# EAGLE design Monotron-002 (EAGLE 9.6.2)
AUTHOR: Peter Konecny; DATE: 13/04/2022; DRAWING_NUMBER: CV_MONOTRON-002; DRAWING_TITLE: Interface between eurorack CV and Monotron; INIT: PK; REV: 2

## Sheet 1 of 3: Block diagram
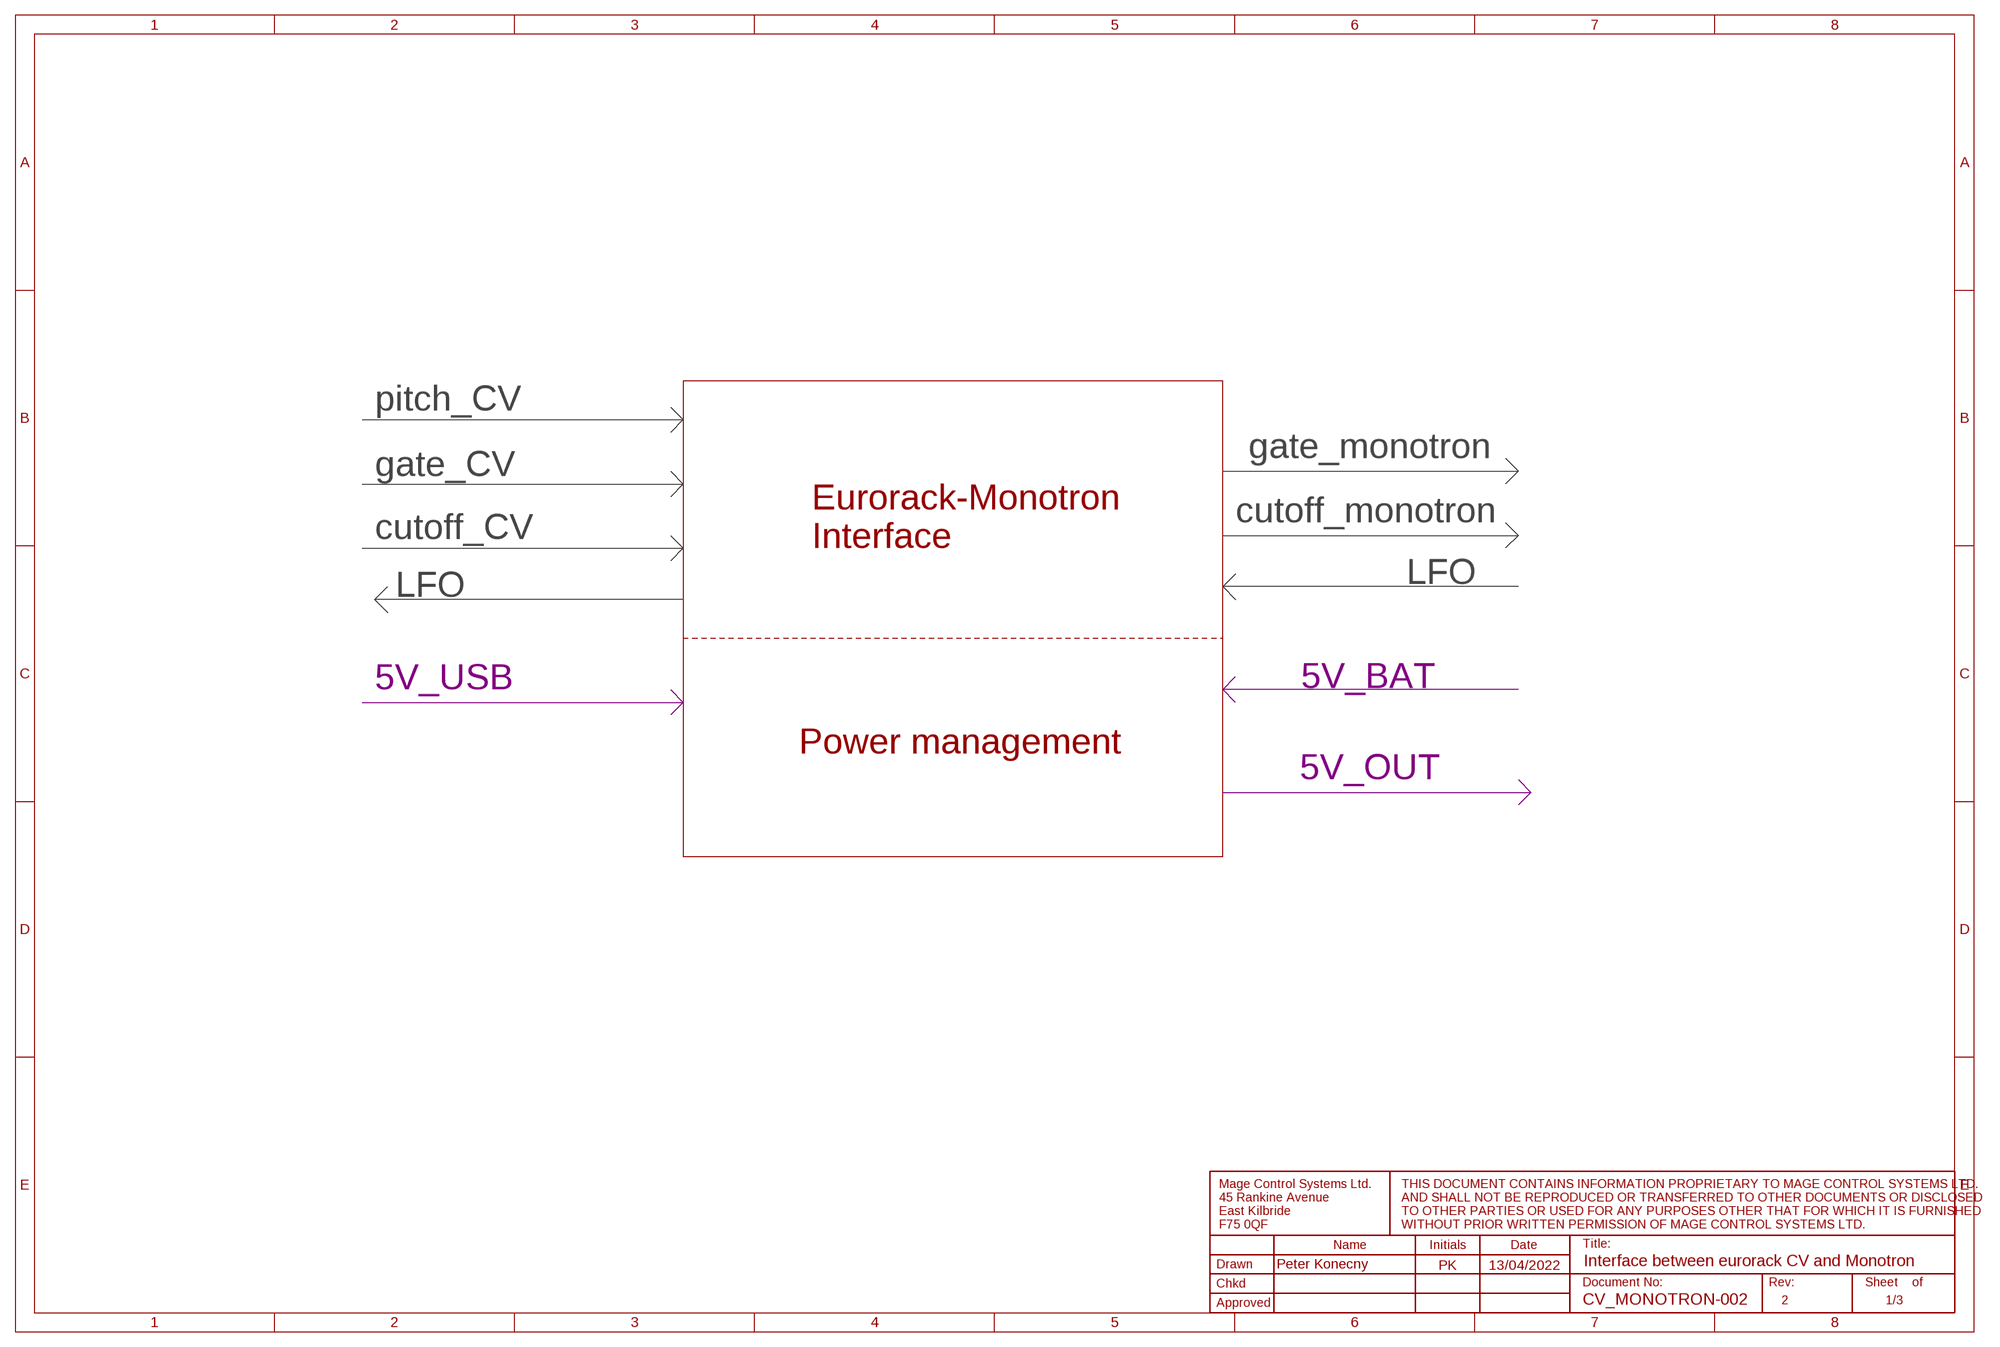
[diagram p0: schematic, sheet 1]

### Notes on the sheet
- pitch_CV
- gate_monotron
- gate_CV
- cutoff_monotron
- cutoff_CV
- Eurorack-Monotron 
  Interface
- LFO
- LFO
- 5V_USB | 5V_BAT
- Power management
- 5V_OUT

## Sheet 2 of 3: eurorack CV interface
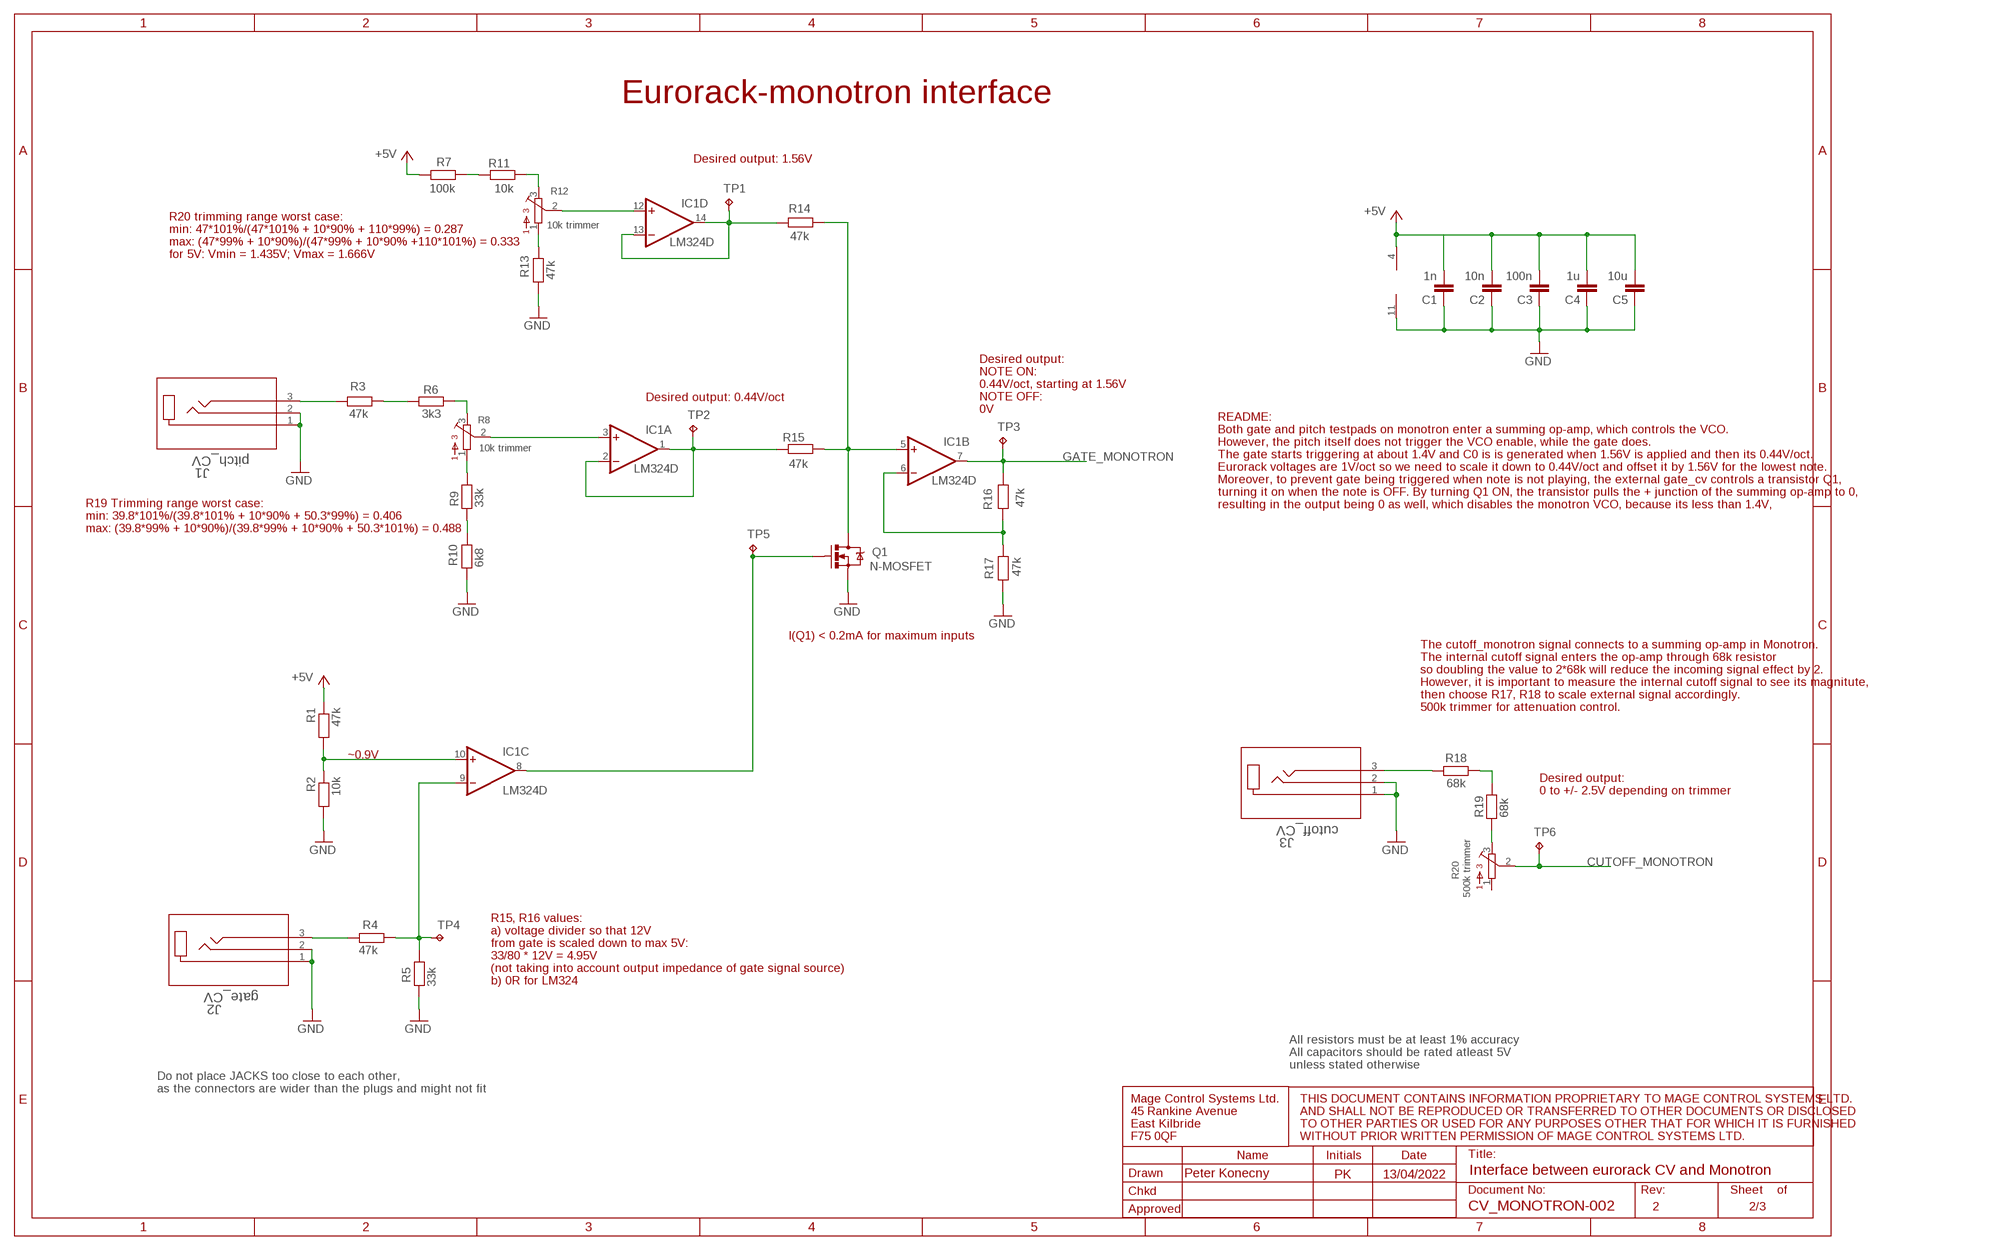
[diagram p1: schematic, sheet 2]

### Parts
C1  1n  C-EUC0603  [C0603]
C2  10n  C-EUC0603  [C0603]
C3  100n  C-EUC0603  [C0603]
C4  1u  C-EUC0603  [C0603]
C5  10u  C-EUC0805  [C0805]
IC1  LM324D  [SO14]
J1  pitch_CV  STX-3000  [STX-3000_KYC]
J2  gate_CV  STX-3000  [STX-3000_KYC]
J3  cutoff_CV  STX-3000  [STX-3000_KYC]
Q1  N-MOSFET  MOSFET-NCHANNELAO3404A  [SOT23-3]
R1  47k  R-EUR0603  [R0603]
R2  10k  R-EUR0603  [R0603]
R3  47k  R-EUR0603  [R0603]
R4  47k  R-EUR0603  [R0603]
R5  33k  R-EUR0603  [R0603]
R6  3k3  R-EUR0603  [R0603]
R7  100k  R-EUR0603  [R0603]
R8  10k trimmer  3362R  [3362R]
R9  33k  R-EUR0603  [R0603]
R10  6k8  R-EUR0603  [R0603]
R11  10k  R-EUR0603  [R0603]
R12  10k trimmer  3362R  [3362R]
R13  47k  R-EUR0603  [R0603]
R14  47k  R-EUR0603  [R0603]
R15  47k  R-EUR0603  [R0603]
R16  47k  R-EUR0603  [R0603]
R17  47k  R-EUR0603  [R0603]
R18  68k  R-EUR0603  [R0603]
R19  68k  R-EUR0603  [R0603]
R20  500k trimmer  3362R  [3362R]
TP1  TPB1,27  [B1,27]
TP2  TPB1,27  [B1,27]
TP3  TPB1,27  [B1,27]
TP4  TPB1,27  [B1,27]
TP5  TPB1,27  [B1,27]
TP6  TPB1,27  [B1,27]

### Nets
+5V: C1.2 C2.2 C3.2 C4.2 C5.2 IC1.4(P:V+) R1.1 R7.2 ; also sheet 3
CUTOFF_MONOTRON: R20.2 TP6.TP ; also sheet 3
GATE_MONOTRON: IC1.7(B:OUT) R16.1 TP3.TP ; also sheet 3
GND [GND]: C1.1 C2.1 C3.1 C4.1 C5.1 IC1.11(P:V-) J1.1 J1.2 J2.1 J2.2 J3.1 J3.2 Q1.2(S) R2.2 R5.2 R10.1 R13.1 R17.2 ; also sheet 3
N$1: R3.2 R6.2
N$2: R9.1 R10.2
N$3: IC1.1(A:OUT) IC1.2(A:-IN) R15.2 TP2.TP
N$4: J1.3 R3.1
N$5: IC1.5(B:+IN) Q1.3(D) R14.1 R15.1
N$6: J3.3 R18.2
N$7: IC1.12(D:+IN) R12.2
N$9: R18.1 R19.2
N$10: R19.1 R20.3
N$11: R8.1 R9.2
N$12: IC1.8(C:OUT) Q1.1(G) TP5.TP
N$13: R6.1 R8.3
N$14: IC1.3(A:+IN) R8.2
N$15: R12.1 R13.2
N$16: R11.1 R12.3
N$17: R7.1 R11.2
N$18: J2.3 R4.2
N$19: IC1.9(C:-IN) R4.1 R5.1 TP4.TP
N$20: IC1.10(C:+IN) R1.2 R2.1
N$21: IC1.13(D:-IN) IC1.14(D:OUT) R14.2 TP1.TP
N$22: IC1.6(B:-IN) R16.2 R17.1
Unconnected: R20.1

### Notes on the sheet
- Eurorack-monotron interface
- Desired output: 1.56V
- R20 trimming range worst case:
  min: 47*101%/(47*101% + 10*90% + 110*99%) = 0.287
  max: (47*99% + 10*90%)/(47*99% + 10*90% +110*101%) = 0.333
  for 5V: Vmin = 1.435V; Vmax = 1.666V
- Desired output: 0.44V/oct
- Desired output: 
  NOTE ON:
  0.44V/oct, starting at 1.56V
  NOTE OFF:
  0V
- README:
  Both gate and pitch testpads on monotron enter a summing op-amp, which controls the VCO. 
  However, the pitch itself does not trigger the VCO enable, while the gate does. 
  The gate starts triggering at about 1.4V and C0 is is generated when 1.56V is applied and then its 0.44V/oct. 
  Eurorack voltages are 1V/oct so we need to scale it down to 0.44V/oct and offset it by 1.56V for the lowest note. 
  Moreover, to prevent gate being triggered when note is not playing, the external gate_cv controls a transistor Q1, 
  turning it on when the note is OFF. By turning Q1 ON, the transistor pulls the + junction of the summing op-amp to 0, 
  resulting in the output being 0 as well, which disables the monotron VCO, because its less than 1.4V,
- R19 Trimming range worst case:
  min: 39.8*101%/(39.8*101% + 10*90% + 50.3*99%) = 0.406
  max: (39.8*99% + 10*90%)/(39.8*99% + 10*90% + 50.3*101%) = 0.488
- I(Q1) < 0.2mA for maximum inputs
- The cutoff_monotron signal connects to a summing op-amp in Monotron. 
  The internal cutoff signal enters the op-amp through 68k resistor 
  so doubling the value to 2*68k will reduce the incoming signal effect by 2. 
  However, it is important to measure the internal cutoff signal to see its magnitute, 
  then choose R17, R18 to scale external signal accordingly.
  500k trimmer for attenuation control.
- ~0.9V
- Desired output: 
  0 to +/- 2.5V depending on trimmer
- R15, R16 values:
  a) voltage divider so that 12V 
  from gate is scaled down to max 5V:
  33/80 * 12V = 4.95V 
  (not taking into account output impedance of gate signal source)
  b) 0R for LM324
- All resistors must be at least 1% accuracy
  All capacitors should be rated atleast 5V
  unless stated otherwise
- Do not place JACKS too close to each other,
  as the connectors are wider than the plugs and might not fit

## Sheet 3 of 3: Power Management + Connectors
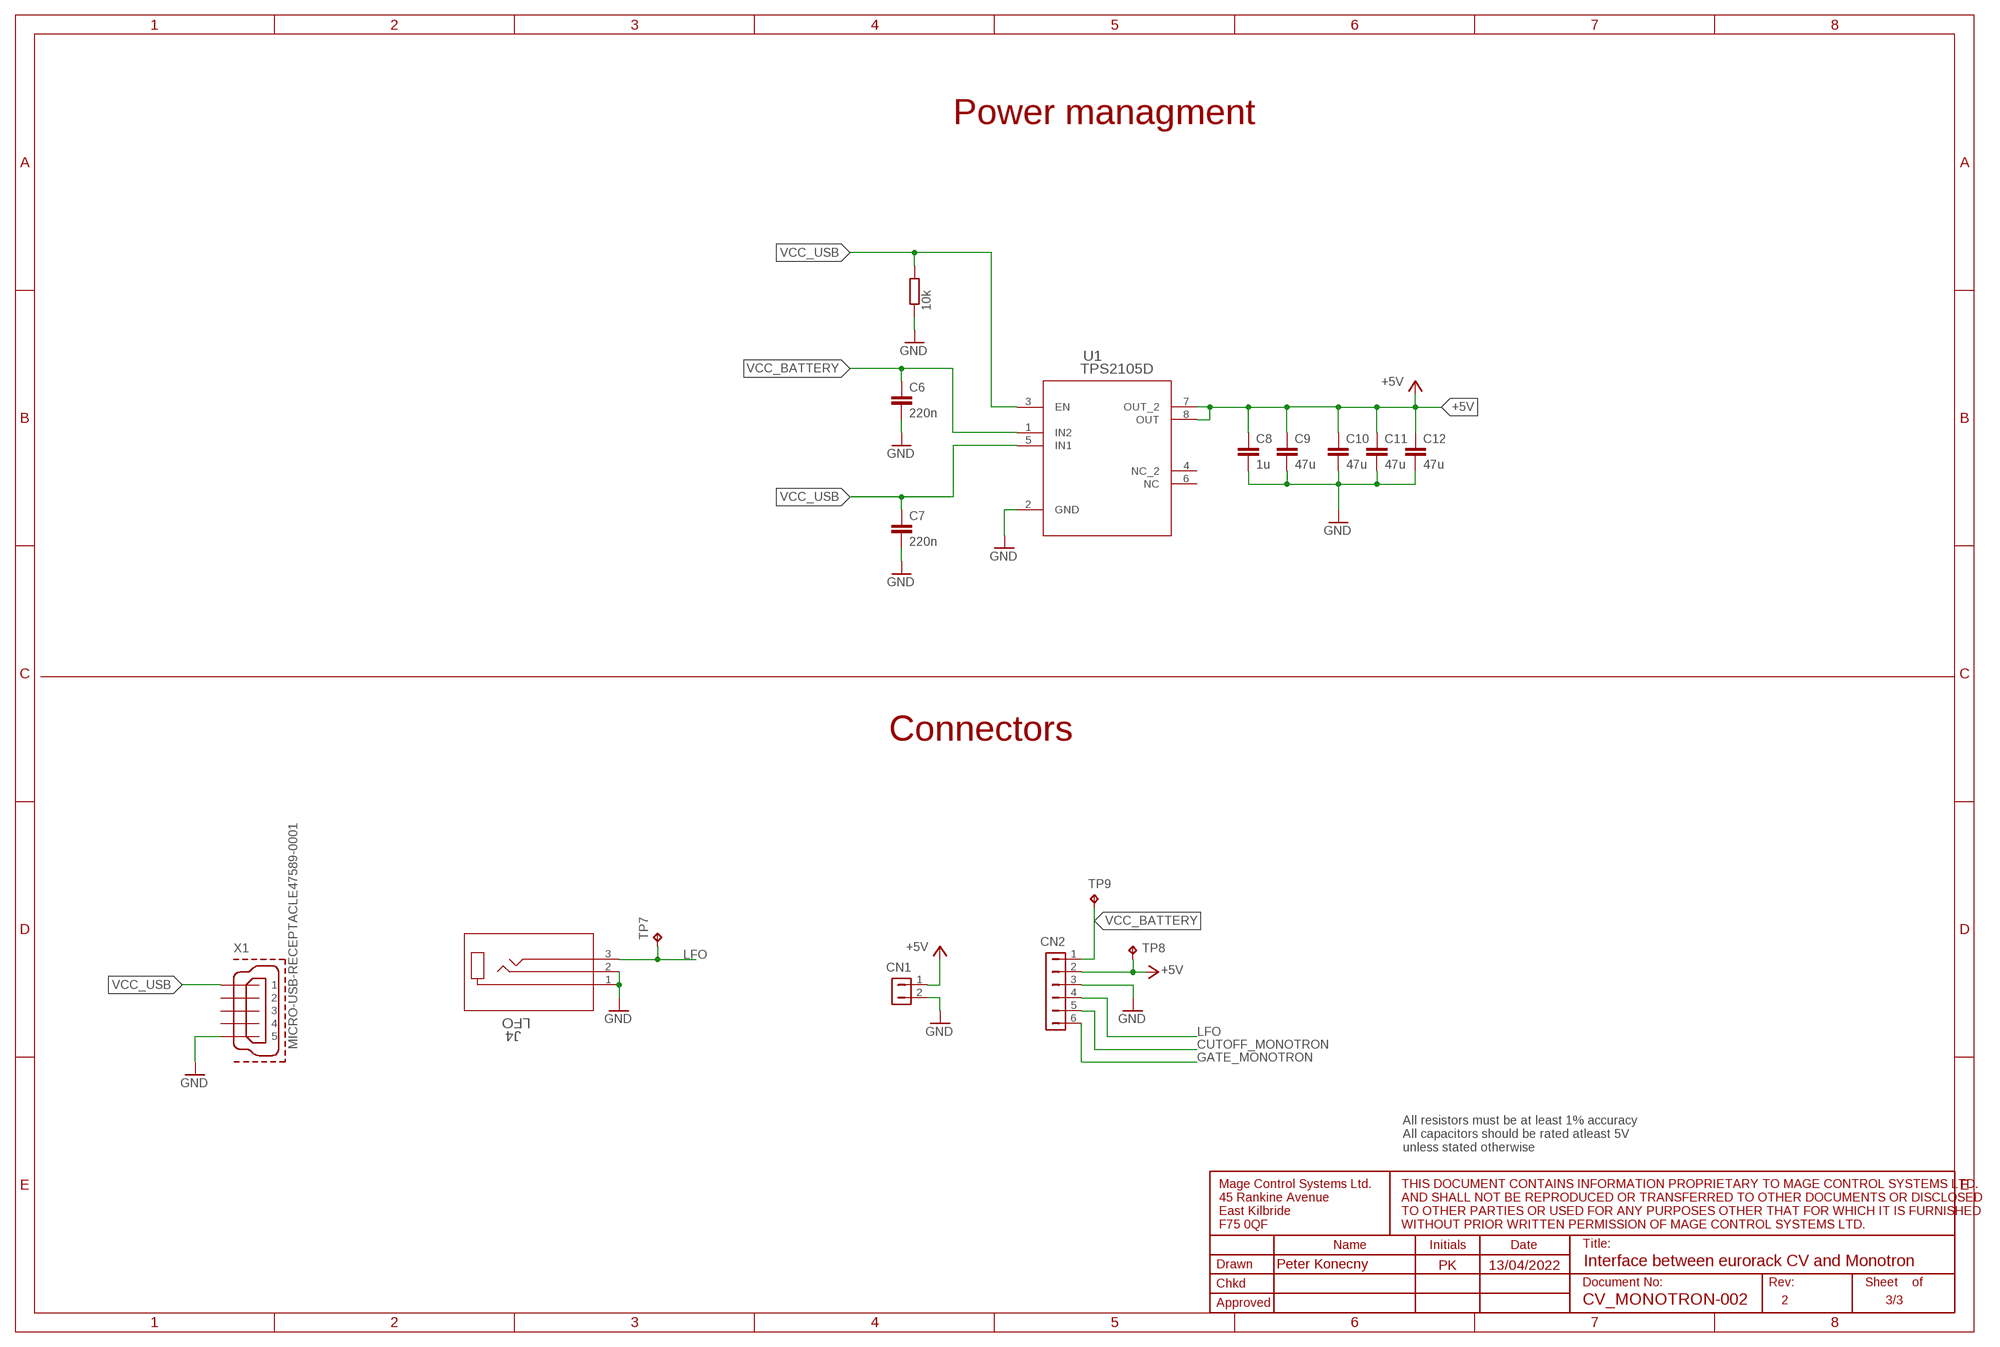
[diagram p2: schematic, sheet 3]

### Parts
C6  220n  C-EUC0603  [C0603]
C7  220n  C-EUC0603  [C0603]
C8  1u  C-EUC0603  [C0603]
C9  47u  C-EUC0805  [C0805]
C10  47u  C-EUC0805  [C0805]
C11  47u  C-EUC0805  [C0805]
C12  47u  C-EUC0805  [C0805]
CN1  HDR-1X2-SIP-100  [SIP-100-2V]
CN2  HDR-1X6-SIP-100  [SIP-100-6V]
J4  LFO  STX-3000  [STX-3000_KYC]
R21  10k  R-EU_R0603  [R0603]
TP7  TPB1,27  [B1,27]
TP8  TPB1,27  [B1,27]
TP9  TPB1,27  [B1,27]
U1  TPS2105D  [D8]
X1  MICRO-USB-RECEPTACLE47589-0001  [47589-0001]

### Nets
+5V: C8.1 C9.1 C10.1 C11.1 C12.1 CN1.1 CN2.2 TP8.TP U1.7(OUT_2) U1.8(OUT) ; also sheet 2
CUTOFF_MONOTRON: CN2.5 ; also sheet 2
GATE_MONOTRON: CN2.6 ; also sheet 2
GND [GND]: C6.2 C7.2 C8.2 C9.2 C10.2 C11.2 C12.2 CN1.2 CN2.3 J4.1 J4.2 R21.1 U1.2(GND) X1.5 ; also sheet 2
LFO: CN2.4 J4.3 TP7.TP
VCC_BATTERY: C6.1 CN2.1 TP9.TP U1.1(IN2)
VCC_USB: C7.1 R21.2 U1.3(EN) U1.5(IN1) X1.1
Unconnected: U1.4(NC_2) U1.6(NC) X1.2 X1.3 X1.4

### Notes on the sheet
- Power managment
- Connectors
- All resistors must be at least 1% accuracy
  All capacitors should be rated atleast 5V
  unless stated otherwise

## Library data of the parts
C1-C5 = Mage-Control:C-EU: CAPACITOR, European symbol
C6-C12 = rcl:C-EU: CAPACITOR, European symbol; SPICEPREFIX: C
CN1 = con-hdrs40:HDR-1X2: HEADER CONNECTOR
CN2 = con-hdrs40:HDR-1X6: HEADER CONNECTOR
IC1 = linear:LM324: OP AMP
J1-J4 = 3.5mm_jack_Kycon:STX-3000; COPYRIGHT: Copyright (C) 2022 Ultra Librarian. All rights reserved.; MANUFACTURER_PART_NUMBER: STX-3000; MFR_NAME: KYCON, INC.
Q1 = SparkFun-DiscreteSemi:MOSFET-NCHANNEL: Common NMOSFET Parts MFG P/N Store ID Prod ID FDD8780 TRANS-09984 SI7820DN TRANS-11055 FDS6630A IC-08089 2N7002PW TRANS-11151 FQP30N06L COM-10213 TRANS-10060 BSS123LT1G TRANS-08345 BSS138 TRANS-00830 BS170 2N7000; PROD_ID: TRAN-12988
R1-R7 R9-R11 R13-R19 = Mage-Control:R-EU: RESISTOR, European symbol
R8 R12 R20 = bourns:3362: 3362 Series 1/4" Square Trimmer
R21 = rcl:R-EU_: RESISTOR, European symbol; SPICEPREFIX: R
TP1-TP9 = testpad:TP: Test pad
U1 = TPS2105D:TPS2105D; COPYRIGHT: Copyright (C) 2022 Ultra Librarian. All rights reserved.; MANUFACTURER_PART_NUMBER: TPS2105D; MFR_NAME: Texas Instruments
X1 = Micro_usb_B:MICRO-USB-RECEPTACLE: MICRO USB RECEPTACLES Micro-USB Receptacles, SMT, Lead-Free from MOLEX <http://www.molex.com/>. (C) 2014 Tomasz Boleslaw CEDRO, cederom@tlen.pl, http://www.tomek.cedro.info. Version 0.1 (2014-01-17): Initial release. Version 0.2 (2014-02-06): Updated 47589-0001 footprint pins/pads/milling. Following devices are included: 1. 47589-0001 Micro-USB AB Receptacle, Bottom Mount, SMT, Lead-Free <http://www.molex.com/molex/products/datasheet.jsp?part=active/0475890001_IO_CONNECTORS.xml> (Technical Drawing <http://www.molex.com/pdm_docs/sd/475890001_sd.pdf>).

## Net classes
0 default: width 0.127 mm, drill 0.2 mm, clearance 0.1 mm
1 GND: width 0.127 mm, drill 0.2 mm, clearance 0.1 mm to class 0, clearance 0.1 mm
2 POWER: width 0.127 mm, drill 0.2 mm, clearance 0.1 mm to class 0, clearance 0.1 mm to class 1, clearance 0.1 mm
3 SIGNAL: width 0.127 mm, drill 0.2 mm, clearance 0.1 mm to class 0, clearance 0.1 mm to class 1, clearance 0.1 mm to class 2, clearance 0.1 mm
4 NC: width 0.127 mm, drill 0.2 mm, clearance 0.1 mm to class 0, clearance 0.1 mm to class 1, clearance 0.1 mm to class 2, clearance 0.1 mm to class 3, clearance 0.1 mm

## Board
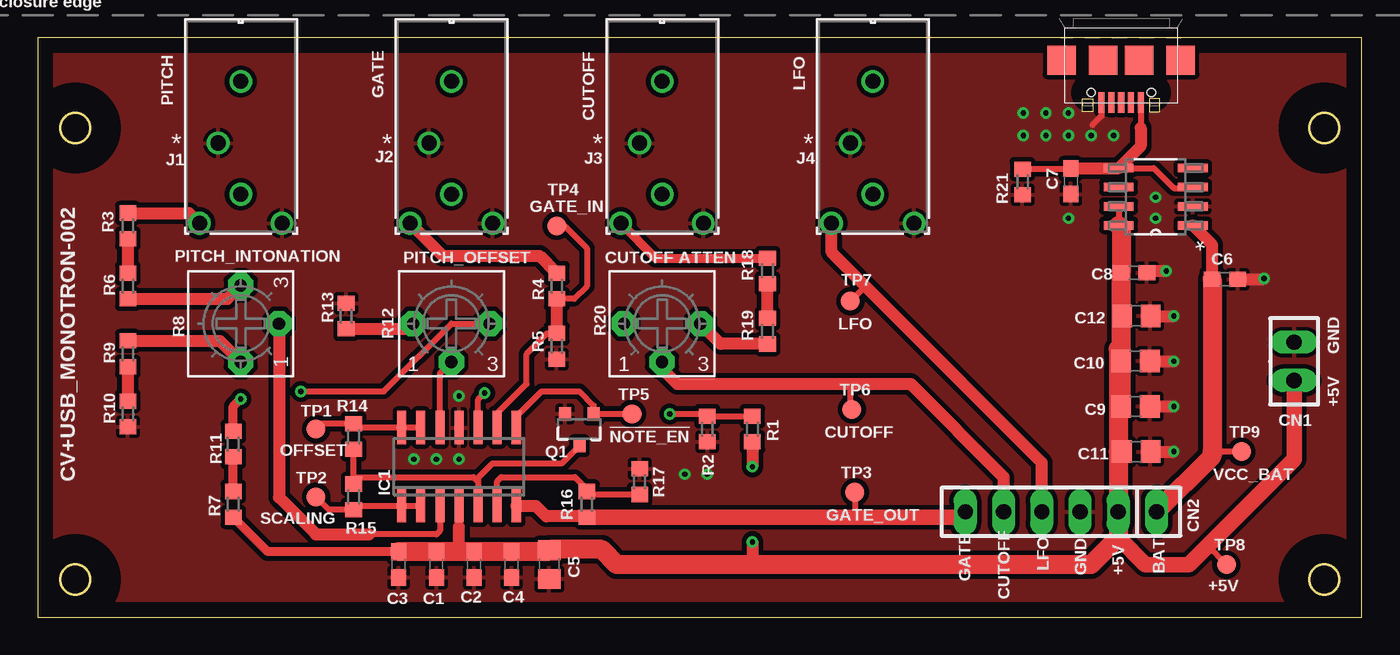
[diagram p3: board, top side]
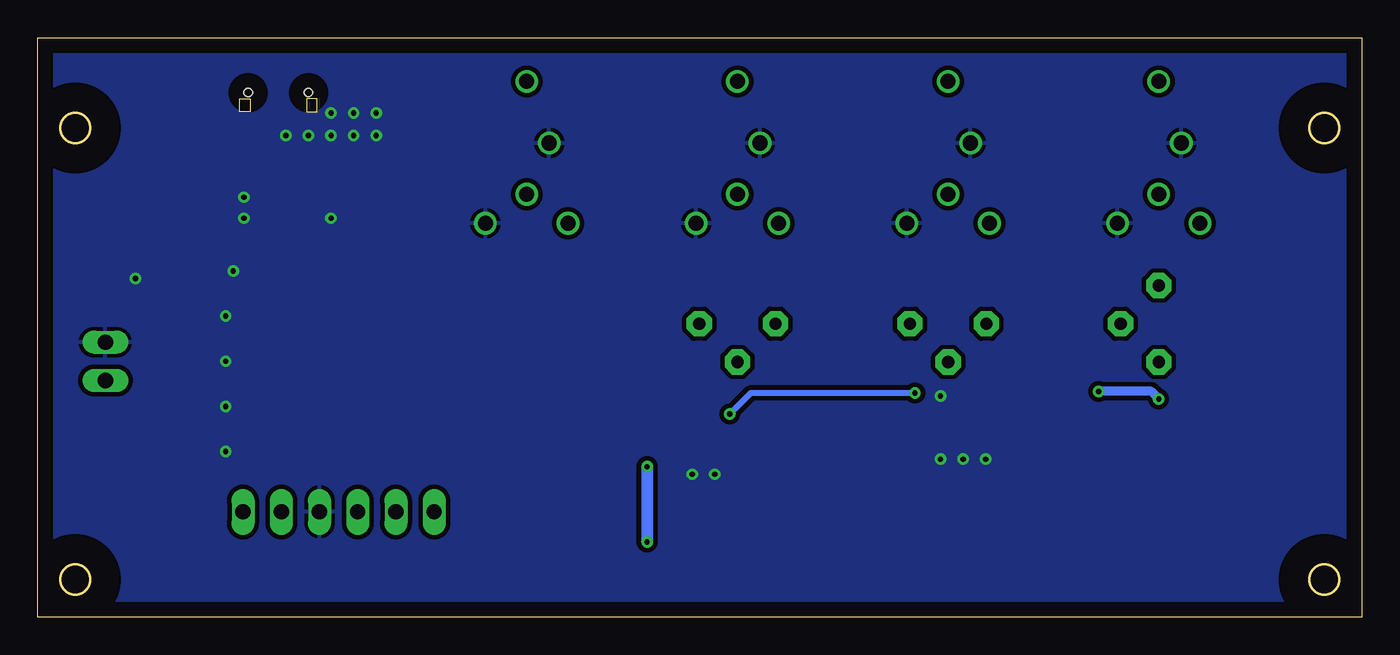
[diagram p4: board, bottom side, seen from below]

Size 88 x 38.5 mm. Coordinates in mm from the lower left corner, seen from the top.
Outline: 0,0 88,0 88,38.5 0,38.5 0,0
Copper layers (1*16): Top 0.035mm / dielectric 1.5mm / Bottom 0.035mm
Design rules "default": minimum track width 6mil, minimum drill 0.35mm, track to track 6mil, track to pad 6mil, pad to pad 6mil, via to via 6mil, smd to smd 6mil, copper to edge 40mil, drill to drill 6mil, minimum pad ring 10mil, minimum via ring 8mil, stop-mask expansion 4mil, vias tented up to drill 0mil, thermal gap 10mil
tKeepout: area 83,30 to 88,35; area 0,30 to 5,35; area 0,0 to 5,5; area 83,0 to 88,5
bKeepout: area 83,30 to 88,35; area 0,30 to 5,35; area 0,0 to 5,5; area 83,0 to 88,5
tRestrict: area 0,0 to 5,5; area 0,30 to 5,35; area 83,30 to 88,35; area 83,0 to 88,5
bRestrict: area 0,0 to 5,5; area 0,30 to 5,35; area 83,30 to 88,35; area 83,0 to 88,5
Milling: area 1.5,31.5 to 3.5,33.5; area 84.5,31.5 to 86.5,33.5; area 1.5,1.5 to 3.5,3.5; area 84.5,1.5 to 86.5,3.5

### Footprints (pad centres in the part's own frame; a part is rotated, then mirrored left to right if it is on the bottom)
C0603 = smd 1.1 x 1: 1 -0.85,0; 2 0.85,0
C0805 = smd 1.3 x 1.5: 1 -0.95,0; 2 0.95,0
SIP-100-2V = drill 1.016 long: 1 -1.27,0; 2 1.27,0
SIP-100-6V = drill 1.016 long: 1 -6.35,0; 2 -3.81,0; 3 -1.27,0; 4 1.27,0; 5 3.81,0; 6 6.35,0
SO14 = smd 0.6 x 2.2: 1 -3.81,-2.6; 2 -2.54,-2.6; 3 -1.27,-2.6; 4 0,-2.6; 5 1.27,-2.6; 6 2.54,-2.6; 7 3.81,-2.6; 8 3.81,2.6; 9 2.54,2.6; 10 1.27,2.6; 11 0,2.6; 12 -1.27,2.6; 13 -2.54,2.6; 14 -3.81,2.6
STX-3000_KYC = drill 1: 1 0,0; 2 4.242,-5.334; 3 -1.245,-5.334 | drill 0.991 pad 0.991: 4 1.499,4.089; 5 1.499,-3.404
SOT23-3 = smd 0.8 x 0.9: 1 -0.95,-1; 2 0.95,-1; 3 0,1.1
R0603 = smd 1 x 1.1: 1 -0.85,0; 2 0.85,0
3362R = drill 0.813 pad 1.676 octagon: 1 -2.54,0; 2 0,-2.54; 3 2.54,0
B1,27 = smd 1.27 x 1.27: TP 0,0
D8 = smd 1.981 x 0.559: 1 -2.464,1.905; 2 -2.464,0.635; 3 -2.464,-0.635; 4 -2.464,-1.905; 5 2.464,-1.905; 6 2.464,-0.635; 7 2.464,0.635; 8 2.464,1.905
47589-0001 = smd 0.4 x 1.35: 1 -1.3,2.8; 2 -0.65,2.8; 3 0,2.8; 4 0.65,2.8; 5 1.3,2.8 | smd 1.9 x 1.9: P$1 -3.95,0; P$2 -1.2,0; P$3 1.2,0; P$4 3.95,0 | hole 0.55: -2,2.15; 2,2.15

### Placement (x,y rotation side)
C1  26.5,3.5 90 top
C2  29,3.5 90 top
C3  24,3.5 90 top
C4  31.5,3.5 90 top
C5  34,3.5 90 top
C6  78.9,22.45 0 top
C7  68.65,28.95 270 top
C8  72.86,22.87 0 top
C9  72.96,14 0 top
C10  72.96,17.02 0 top
C11  73,11 0 top
C12  73,20.02 0 top
CN1  83.5,17 90 top
CN2  68,7 180 top
IC1  28,10 0 top
J1  12,31.5 0 top
J2  26,31.5 0 top
J3  40,31.5 0 top
J4  54,31.5 0 top
Q1  36,12.5 180 top
R1  47.5,12.5 90 top
R2  44.5,12.5 270 top
R3  6,26 270 top
R4  34.5,22 90 top
R5  34.5,18 270 top
R6  6,22 90 top
R7  13,7.5 270 top
R8  13.5,19.5 90 top
R9  6,17.5 90 top
R10  6,13.5 90 top
R11  13,11.5 270 top
R12  27.5,19.5 0 top
R13  20.5,20 270 top
R14  21,12 90 top
R15  21,8 270 top
R16  36.5,7.5 90 top
R17  40,9 90 top
R18  48.5,23 90 top
R19  48.5,19 90 top
R20  41.5,19.5 0 top
R21  65.45,28.92 90 top
TP1  18.5,12.5 0 top
TP2  18.5,8 0 top
TP3  54.3,8.3 0 top
TP4  34.5,26 0 top
TP5  39.5,13.5 0 top
TP6  54.1,13.8 0 top
TP7  54,21 0 top
TP8  79,3.5 0 top
TP9  80,11 0 top
U1  74.3,27.93 180 top
X1  72,37 180 top

### Tracks (layer width: path | path; a pad name or v marks a point on that pad's centre or on a via)
+5V  (via drill 0.35)
  Top 0.406: U1.7 U1.8 | IC1.4 28,6 | C11.1 71.81,11 | TP8.TP 77.75,4.75
  Top 0.61: C3.2 15.3,4.35 R7.2
  Top 0.813: 28,4.35 28,6 | R1.1 v47.5,10 | v47.5,5 47.5,3.5
  Top 1.016: 71.81,5.31 73.62,3.5 76.5,3.5 77.75,4.75 83.5,10.5 CN1.1
  Top 1.27: U1.8 72.01,25.85 C8.1 72.01,20.06 C12.1 72.01,19.98 C10.1 C9.1 72,18 71.81,17.81 71.81,11 CN2.2 71.81,5.31 70,3.5 47.5,3.5 38.5,3.5 37.5,4.5 34.05,4.5 C5.2 33.9,4.35 C4.2 C2.2 28,4.35 C1.2 C3.2
  Bottom 0.813: v47.5,10 v47.5,5
CUTOFF_MONOTRON
  Top 0.406: TP6.TP 54,13.9 54,15.5
  Top 0.813: R20.2 41.5,16.5 42.5,15.5 54,15.5 58,15.5 64.19,9.31 CN2.5
GATE_MONOTRON
  Top 0.406: TP3.TP 54.3,6.95 54,6.65
  Top 0.813: IC1.7 33.1,7.4 33.8,6.7 36.45,6.7 R16.1
  Top 1.016: R16.1 54,6.65 57.5,6.65 61.3,6.65 CN2.6
GND  (via drill 0.35)
  Top 0.406: X1.5 70.7,33.3 70.1,32.7
  Top 0.813: R21.1 65.5,28.02 | C6.2 81.45,22.45 v81.5,22.5 | C8.2 73.84,23 v75,23 | C12.2 73.97,20 v75.5,20 | C10.2 73.93,17 v75.5,17 | C9.2 v75.5,14 | C11.2 v75.5,11
  other vias: 68.5,26.5 74.3,27.9 74.3,26.5 28,10.5 26.5,10.5 25,10.5 28,14.7 65.5,33.5 65.5,32 67,33.5 68.5,32 67,32 68.5,33.5 70,32 71.5,32 43,9.5 44.5,9.5
  pour Top (isolate 0.305): -2,39.5 -2,-1.5 94,-1.5 94,39.5
  pour Bottom (isolate 0.305): -1.5,39 -1.5,-1 92,-1 92,39
LFO
  Top 0.406: TP7.TP 55,22
  Top 0.813: CN2.4 66.73,10.27 55,22 52.76,24.25 J4.3
N$1
  Top 0.813: R3.2 R6.2
N$2
  Top 0.813: R9.1 R10.2
N$3
  Top 0.406: IC1.2 IC1.1 21.25,7.4 R15.2 19.35,7.15 TP2.TP
N$4
  Top 0.813: R3.1 10.07,26.85 J1.3
N$5
  Top 0.406: Q1.3 34.8,10.2 30.2,10.2 29.27,9.27 29.27,9 | 29.27,9 IC1.5 | R15.1 21,9.3 | 21,9.3 R14.1 | 21,9.3 28.97,9.3 29.27,9
N$6
  Top 0.61: J3.3 41.07,23.85 R18.2
N$7
  Top 0.406: IC1.12 26.73,16.19 R12.2
N$9
  Top 0.813: R19.2 R18.1
N$10
  Top 0.813: R19.1 45.39,18.15 R20.3
N$11
  Top 0.813: R9.2 12.11,18.35 R8.1
N$12
  Top 0.406: IC1.8 31.81,13.31 33.5,15 36,15 36.95,14.05 Q1.1 TP5.TP
N$13
  Top 0.813: R6.1 12.61,21.15 R8.3
N$14
  Top 0.406: IC1.3 26.73,5.73 26.5,5.5 22,5.5
  Top 0.813: R8.2 16.04,7.96 18.5,5.5 22,5.5
N$15
  Top 0.813: R13.2 24.61,19.15 R12.1
N$16  (via drill 0.35)
  Top 0.406: R12.3 27.5,19.5 23,15 v17.5,15
  Top 0.61: R11.1 13,14 v13.5,14.5
  Bottom 0.61: v13.5,14.5 14,15 v17.5,15
N$17
  Top 0.61: R7.1 R11.2
N$18
  Top 0.813: J2.3 26.92,24 33.35,24 R4.2
N$19
  Top 0.406: R5.1 33.85,18.85 32.5,17.5 32.5,15.5 30.54,13.54 IC1.9 | TP4.TP 35,26 36.5,24.5 36.5,22 35.65,21.15 R4.1
  Top 0.813: R4.1 R5.1
N$20  (via drill 0.35)
  Top 0.406: IC1.10 29.27,14.47 v29.7,14.9 | v42,13.5 44.35,13.5 R2.1 R1.2
  Bottom 0.406: v29.7,14.9 40.6,14.9 v42,13.5
N$21
  Top 0.406: IC1.13 IC1.14 21.25,12.6 R14.2 18.85,12.85 TP1.TP
N$22
  Top 0.406: IC1.6 30.54,9.04 30.8,9.3 35.7,9.3 36.5,8.5 R16.2 36.7,8.15 R17.1
VCC_BATTERY
  Top 0.406: TP9.TP 78.05,11
  Top 0.813: C6.1 78.05,24.74 U1.1
  Top 1.27: C6.1 78.05,11 78.05,10.7 CN2.1
VCC_USB
  Top 0.406: U1.5 74.17,29.84 75.5,28.5 76.7,28.5 U1.3 | X1.1 73.3,32.5 | R21.2 65.48,29.8 C7.1
  Top 0.813: C7.1 68.69,29.84 U1.5 73.3,31.3 73.3,32.5

### Text on the board
tNames: Enclosure edge | LFO | PITCH | GATE | CUTOFF | J1 | J2 | J3 | J4 | GATE_IN | PITCH_INTONATION | PITCH_OFFSET | CUTOFF ATTEN | LFO | GND | +5V | !NOTE_EN | CUTOFF | OFFSET | CV+USB_MONOTRON-002 | VCC_BAT | SCALING | GATE_OUT | LFO | GND | +5V | BAT | GATE | +5V | CUTOFF